# EAGLE design line_sensor (EAGLE 9.6.2)
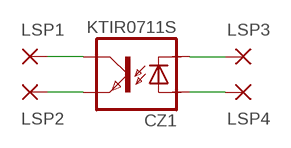
[diagram p0: schematic, sheet 1]

## Parts
CZ1  KTIR0711S  [TOP]
LSP1  1,6/0,9  [1,6/0,9]
LSP2  1,6/0,9  [1,6/0,9]
LSP3  1,6/0,9  [1,6/0,9]
LSP4  1,6/0,9  [1,6/0,9]

## Nets
N$1: CZ1.KOLEKTOR LSP1.1(P)
N$2: CZ1.EMITER LSP2.1(P)
N$3: CZ1.KATODA LSP3.1(P)
N$4: CZ1.ANODA LSP4.1(P)

## Library data of the parts
CZ1 = KTIR0711S:KTIR0711S
LSP1-LSP4 = wirepad:1,6/0,9: THROUGH-HOLE PAD

## Board
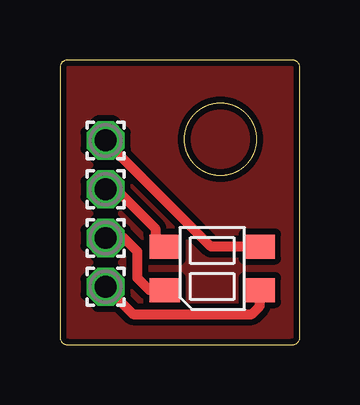
[diagram p1: board, top side]
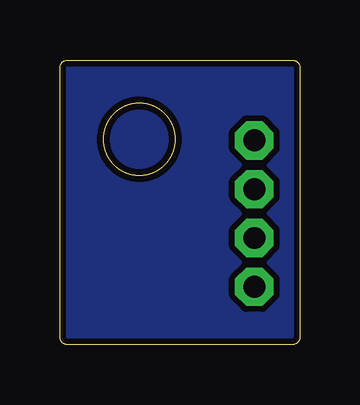
[diagram p2: board, bottom side, seen from below]

Size 10.01 x 11.86 mm. Coordinates in mm from the lower left corner, seen from the top.
Outline: 10.01,0.32 10.01,11.54 arc90 9.7,11.86 0.32,11.86 arc90 0,11.54 0,0.32 arc90 0.32,0 9.7,0 arc90 10.01,0.32
Outline: circle at 6.7,8.56 radius 1.5
Copper layers (1*16): Top 0.035mm / dielectric 1.5mm / Bottom 0.035mm
Design rules "default *": minimum track width 6mil, minimum drill 0.35mm, track to track 6mil, track to pad 6mil, pad to pad 6mil, via to via 6mil, smd to smd 6mil, copper to edge 1mil, drill to drill 6mil, minimum pad ring 10mil, minimum via ring 8mil, stop-mask expansion 4mil, vias tented up to drill 0mil, thermal gap 10mil

### Footprints (pad centres in the part's own frame; a part is rotated, then mirrored left to right if it is on the bottom)
TOP = smd 1.27 x 1: ANODA -1.985,-0.9; EMITER -1.985,0.9; KATODA 1.985,-0.9; KOLEKTOR 1.985,0.91
1,6/0,9 = drill 0.914 pad 1.6 octagon: 1 0,0

### Placement (x,y rotation side)
CZ1  6.35,3.17 0 top
LSP1  1.91,8.51 0 top
LSP2  1.91,6.48 0 top
LSP3  1.91,2.41 0 top
LSP4  1.91,4.45 0 top

### Tracks (layer width: path | path; a pad name or v marks a point on that pad's centre or on a via)
GND
  pour Top (isolate 0.254): 0,11.94 10.03,11.94 10.03,0 0,0
  pour Bottom (isolate 0.254): 0,11.94 10.03,11.94 10.03,0 0,0
N$1
  Top 0.406: CZ1.KOLEKTOR 6.3,4.08 1.91,8.48 LSP1.1
N$2
  Top 0.406: LSP2.1 2.34,6.48 3.98,4.84 3.98,4.46 CZ1.EMITER
N$3
  Top 0.406: LSP3.1 3.05,1.27 8,1.27 8.34,1.6 CZ1.KATODA
N$4
  Top 0.406: LSP4.1 2.67,4.45 3.22,3.89 3.22,2.78 3.73,2.27 CZ1.ANODA